# EAGLE schematic FMC_P_CAM (EAGLE 6.5.0)

## Sheet 1 of 4
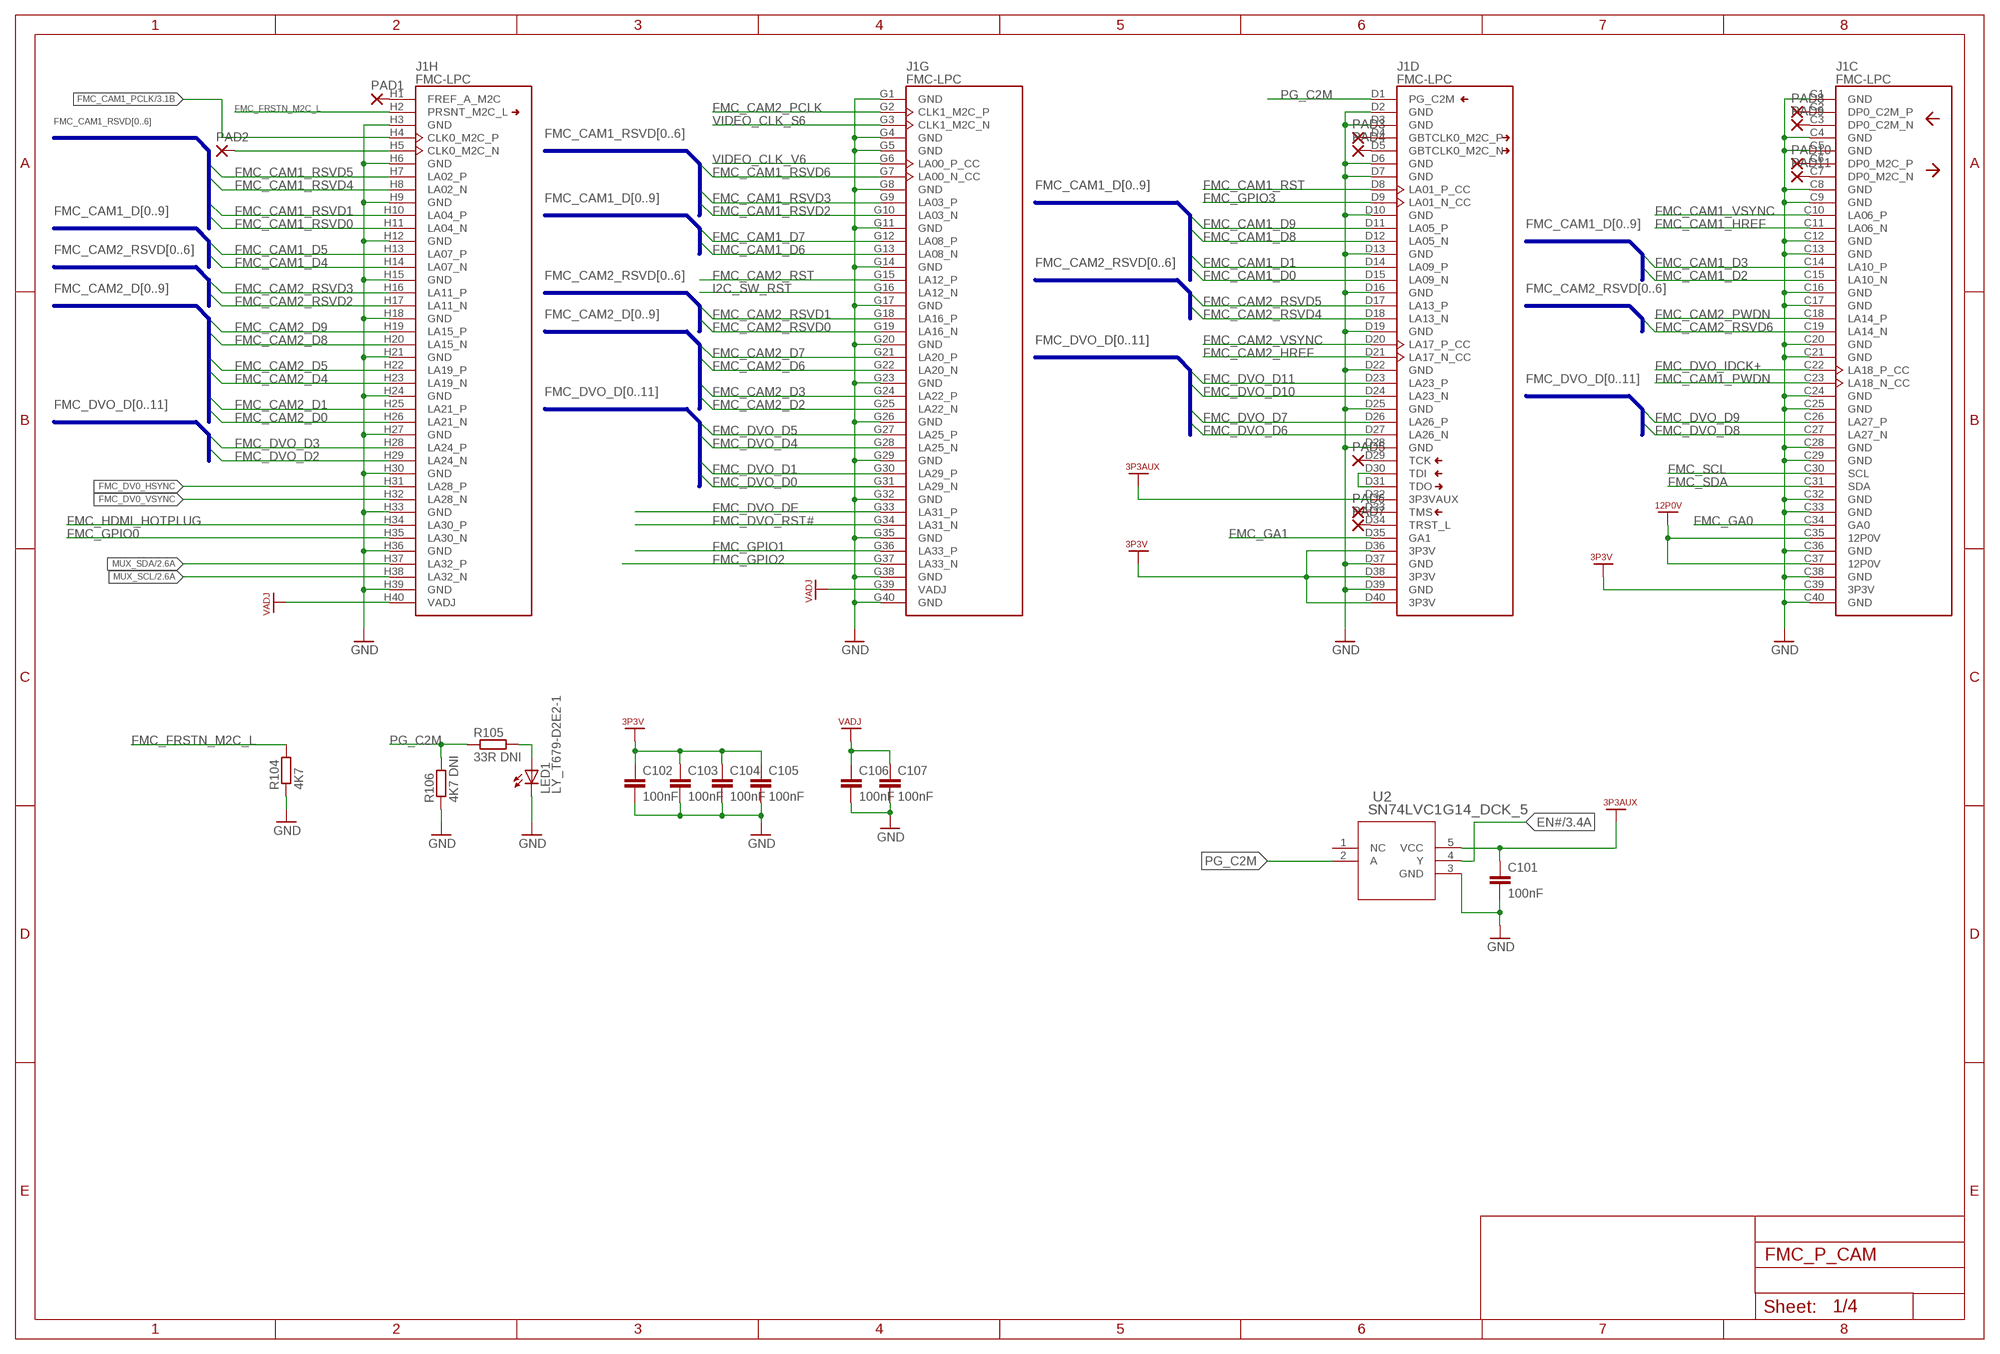
[diagram p0: schematic, sheet 1]

### Parts
C101  100nF  C-EUC0603  [C0603]
C102  100nF  C-EUC0603  [C0603]
C103  100nF  C-EUC0603  [C0603]
C104  100nF  C-EUC0603  [C0603]
C105  100nF  C-EUC0603  [C0603]
C106  100nF  C-EUC0603  [C0603]
C107  100nF  C-EUC0603  [C0603]
J1  FMC-LPC  [FMC-LPC-MALE]
LED1  LY_T679-D2E2-1  [PLCC2]
PAD1  1,6/0,8  [1,6/0,8]
PAD2  1,6/0,8  [1,6/0,8]
PAD3  1,6/0,8  [1,6/0,8]
PAD4  1,6/0,8  [1,6/0,8]
PAD5  1,6/0,8  [1,6/0,8]
PAD6  1,6/0,8  [1,6/0,8]
PAD7  1,6/0,8  [1,6/0,8]
PAD8  1,6/0,8  [1,6/0,8]
PAD9  1,6/0,8  [1,6/0,8]
PAD10  1,6/0,8  [1,6/0,8]
PAD11  1,6/0,8  [1,6/0,8]
R104  4K7  R-EU_R0603  [R0603]
R105  33R DNI  R-EU_R0603  [R0603]
R106  4K7 DNI  R-EU_R0603  [R0603]
U2  SN74LVC1G14_DCK_5  [DCK5]

### Nets
3P3AUX: C101.1 J1.D32(D:3P3VAUX) U2.5(VCC)
3P3V: C102.1 C103.1 C104.1 C105.1 J1.C39(C:3P3V) J1.D36(D:3P3V) J1.D38(D:3P3V) J1.D40(D:3P3V) ; also sheet 2,3
12P0V: J1.C35(C:12P0V) J1.C37(C:12P0V) ; also sheet 4
EN#: U2.4(Y) ; also sheet 3
FMC_CAM1_D0: J1.D15(D:LA09_N) ; also sheet 3
FMC_CAM1_D1: J1.D14(D:LA09_P) ; also sheet 3
FMC_CAM1_D2: J1.C15(C:LA10_N) ; also sheet 3
FMC_CAM1_D3: J1.C14(C:LA10_P) ; also sheet 3
FMC_CAM1_D4: J1.H14(H:LA07_N) ; also sheet 3
FMC_CAM1_D5: J1.H13(H:LA07_P) ; also sheet 3
FMC_CAM1_D6: J1.G13(G:LA08_N) ; also sheet 3
FMC_CAM1_D7: J1.G12(G:LA08_P) ; also sheet 3
FMC_CAM1_D8: J1.D12(D:LA05_N) ; also sheet 3
FMC_CAM1_D9: J1.D11(D:LA05_P) ; also sheet 3
FMC_CAM1_HREF: J1.C11(C:LA06_N) ; also sheet 3
FMC_CAM1_PCLK: J1.H4(H:CLK0_M2C_P) ; also sheet 3
FMC_CAM1_PWDN: J1.C23(C:LA18_N_CC) ; also sheet 3
FMC_CAM1_RST: J1.D8(D:LA01_P_CC) ; also sheet 3
FMC_CAM1_RSVD0: J1.H11(H:LA04_N) ; also sheet 3
FMC_CAM1_RSVD1: J1.H10(H:LA04_P) ; also sheet 3
FMC_CAM1_RSVD2: J1.G10(G:LA03_N) ; also sheet 3
FMC_CAM1_RSVD3: J1.G9(G:LA03_P) ; also sheet 3
FMC_CAM1_RSVD4: J1.H8(H:LA02_N) ; also sheet 3
FMC_CAM1_RSVD5: J1.H7(H:LA02_P) ; also sheet 3
FMC_CAM1_RSVD6: J1.G7(G:LA00_N_CC) ; also sheet 3
FMC_CAM1_VSYNC: J1.C10(C:LA06_P) ; also sheet 3
FMC_CAM2_D0: J1.H26(H:LA21_N) ; also sheet 3
FMC_CAM2_D1: J1.H25(H:LA21_P) ; also sheet 3
FMC_CAM2_D2: J1.G25(G:LA22_N) ; also sheet 3
FMC_CAM2_D3: J1.G24(G:LA22_P) ; also sheet 3
FMC_CAM2_D4: J1.H23(H:LA19_N) ; also sheet 3
FMC_CAM2_D5: J1.H22(H:LA19_P) ; also sheet 3
FMC_CAM2_D6: J1.G22(G:LA20_N) ; also sheet 3
FMC_CAM2_D7: J1.G21(G:LA20_P) ; also sheet 3
FMC_CAM2_D8: J1.H20(H:LA15_N) ; also sheet 3
FMC_CAM2_D9: J1.H19(H:LA15_P) ; also sheet 3
FMC_CAM2_HREF: J1.D21(D:LA17_N_CC) ; also sheet 3
FMC_CAM2_PCLK: J1.G2(G:CLK1_M2C_P) ; also sheet 3
FMC_CAM2_PWDN: J1.C18(C:LA14_P) ; also sheet 3
FMC_CAM2_RST: J1.G15(G:LA12_P) ; also sheet 3
FMC_CAM2_RSVD0: J1.G19(G:LA16_N) ; also sheet 3
FMC_CAM2_RSVD1: J1.G18(G:LA16_P) ; also sheet 3
FMC_CAM2_RSVD2: J1.H17(H:LA11_N) ; also sheet 3
FMC_CAM2_RSVD3: J1.H16(H:LA11_P) ; also sheet 3
FMC_CAM2_RSVD4: J1.D18(D:LA13_N) ; also sheet 3
FMC_CAM2_RSVD5: J1.D17(D:LA13_P) ; also sheet 3
FMC_CAM2_RSVD6: J1.C19(C:LA14_N) ; also sheet 3
FMC_CAM2_VSYNC: J1.D20(D:LA17_P_CC) ; also sheet 3
FMC_DV0_HSYNC: J1.H31(H:LA28_P)
FMC_DV0_VSYNC: J1.H32(H:LA28_N)
FMC_DVO_D0: J1.G31(G:LA29_N)
FMC_DVO_D1: J1.G30(G:LA29_P)
FMC_DVO_D2: J1.H29(H:LA24_N)
FMC_DVO_D3: J1.H28(H:LA24_P)
FMC_DVO_D4: J1.G28(G:LA25_N)
FMC_DVO_D5: J1.G27(G:LA25_P)
FMC_DVO_D6: J1.D27(D:LA26_N)
FMC_DVO_D7: J1.D26(D:LA26_P)
FMC_DVO_D8: J1.C27(C:LA27_N)
FMC_DVO_D9: J1.C26(C:LA27_P)
FMC_DVO_D10: J1.D24(D:LA23_N)
FMC_DVO_D11: J1.D23(D:LA23_P)
FMC_DVO_DE: J1.G33(G:LA31_P)
FMC_DVO_IDCK+: J1.C22(C:LA18_P_CC)
FMC_DVO_RST#: J1.G34(G:LA31_N)
FMC_FRSTN_M2C_L: J1.H2(H:PRSNT_M2C_L) R104.2
FMC_GA0: J1.C34(C:GA0)
FMC_GA1: J1.D35(D:GA1)
FMC_GPIO0: J1.H35(H:LA30_N)
FMC_GPIO1: J1.G36(G:LA33_P)
FMC_GPIO2: J1.G37(G:LA33_N)
FMC_GPIO3: J1.D9(D:LA01_N_CC)
FMC_HDMI_HOTPLUG: J1.H34(H:LA30_P)
FMC_SCL: J1.C30(C:SCL)
FMC_SDA: J1.C31(C:SDA)
GND: C101.2 C102.2 C103.2 C104.2 C105.2 C106.2 C107.2 J1.C1(C:GND) J1.C4(C:GND) J1.C5(C:GND) J1.C8(C:GND) J1.C9(C:GND) J1.C12(C:GND) J1.C13(C:GND) J1.C16(C:GND) J1.C17(C:GND) J1.C20(C:GND) J1.C21(C:GND) J1.C24(C:GND) J1.C25(C:GND) J1.C28(C:GND) J1.C29(C:GND) J1.C32(C:GND) J1.C33(C:GND) J1.C36(C:GND) J1.C38(C:GND) J1.C40(C:GND) J1.D2(D:GND) J1.D3(D:GND) J1.D6(D:GND) J1.D7(D:GND) J1.D10(D:GND) J1.D13(D:GND) J1.D16(D:GND) J1.D19(D:GND) J1.D22(D:GND) J1.D25(D:GND) J1.D28(D:GND) J1.D37(D:GND) J1.D39(D:GND) J1.G1(G:GND) J1.G4(G:GND) J1.G5(G:GND) J1.G8(G:GND) J1.G11(G:GND) J1.G14(G:GND) J1.G17(G:GND) J1.G20(G:GND) J1.G23(G:GND) J1.G26(G:GND) J1.G29(G:GND) J1.G32(G:GND) J1.G35(G:GND) J1.G38(G:GND) J1.G40(G:GND) J1.H3(H:GND) J1.H6(H:GND) J1.H9(H:GND) J1.H12(H:GND) J1.H15(H:GND) J1.H18(H:GND) J1.H21(H:GND) J1.H24(H:GND) J1.H27(H:GND) J1.H30(H:GND) J1.H33(H:GND) J1.H36(H:GND) J1.H39(H:GND) LED1.C R104.1 R106.1 U2.3(GND) ; also sheet 2,3,4
I2C_SW_RST: J1.G16(G:LA12_N) ; also sheet 2
MUX_SCL: J1.H38(H:LA32_N) ; also sheet 2
MUX_SDA: J1.H37(H:LA32_P) ; also sheet 2
N$1: J1.H5(H:CLK0_M2C_N) PAD2.1(P)
N$2: LED1.A R105.2
N$4: J1.D30(D:TDI) J1.D31(D:TDO)
N$22: J1.H1(H:FREF_A_M2C) PAD1.1(P)
N$26: J1.D4(D:GBTCLK0_M2C_P) PAD3.1(P)
N$27: J1.D5(D:GBTCLK0_M2C_N) PAD4.1(P)
N$28: J1.D29(D:TCK) PAD5.1(P)
N$29: J1.D33(D:TMS) PAD6.1(P)
N$30: J1.D34(D:TRST_L) PAD7.1(P)
N$31: J1.C2(C:DP0_C2M_P) PAD8.1(P)
N$32: J1.C3(C:DP0_C2M_N) PAD9.1(P)
N$33: J1.C6(C:DP0_M2C_P) PAD10.1(P)
N$34: J1.C7(C:DP0_M2C_N) PAD11.1(P)
PG_C2M: J1.D1(D:PG_C2M) R105.1 R106.2 U2.2(A)
VADJ: C106.1 C107.1 J1.G39(G:VADJ) J1.H40(H:VADJ) ; also sheet 2,3
VIDEO_CLK_S6: J1.G3(G:CLK1_M2C_N)
VIDEO_CLK_V6: J1.G6(G:LA00_P_CC)
Unconnected: U2.1(NC)

### Buses
FMC_CAM1_RSVD[0..6]
FMC_CAM1_D[0..9]
FMC_CAM2_RSVD[0..6]
FMC_CAM2_D[0..9]
FMC_DVO_D[0..11]

## Sheet 2 of 4
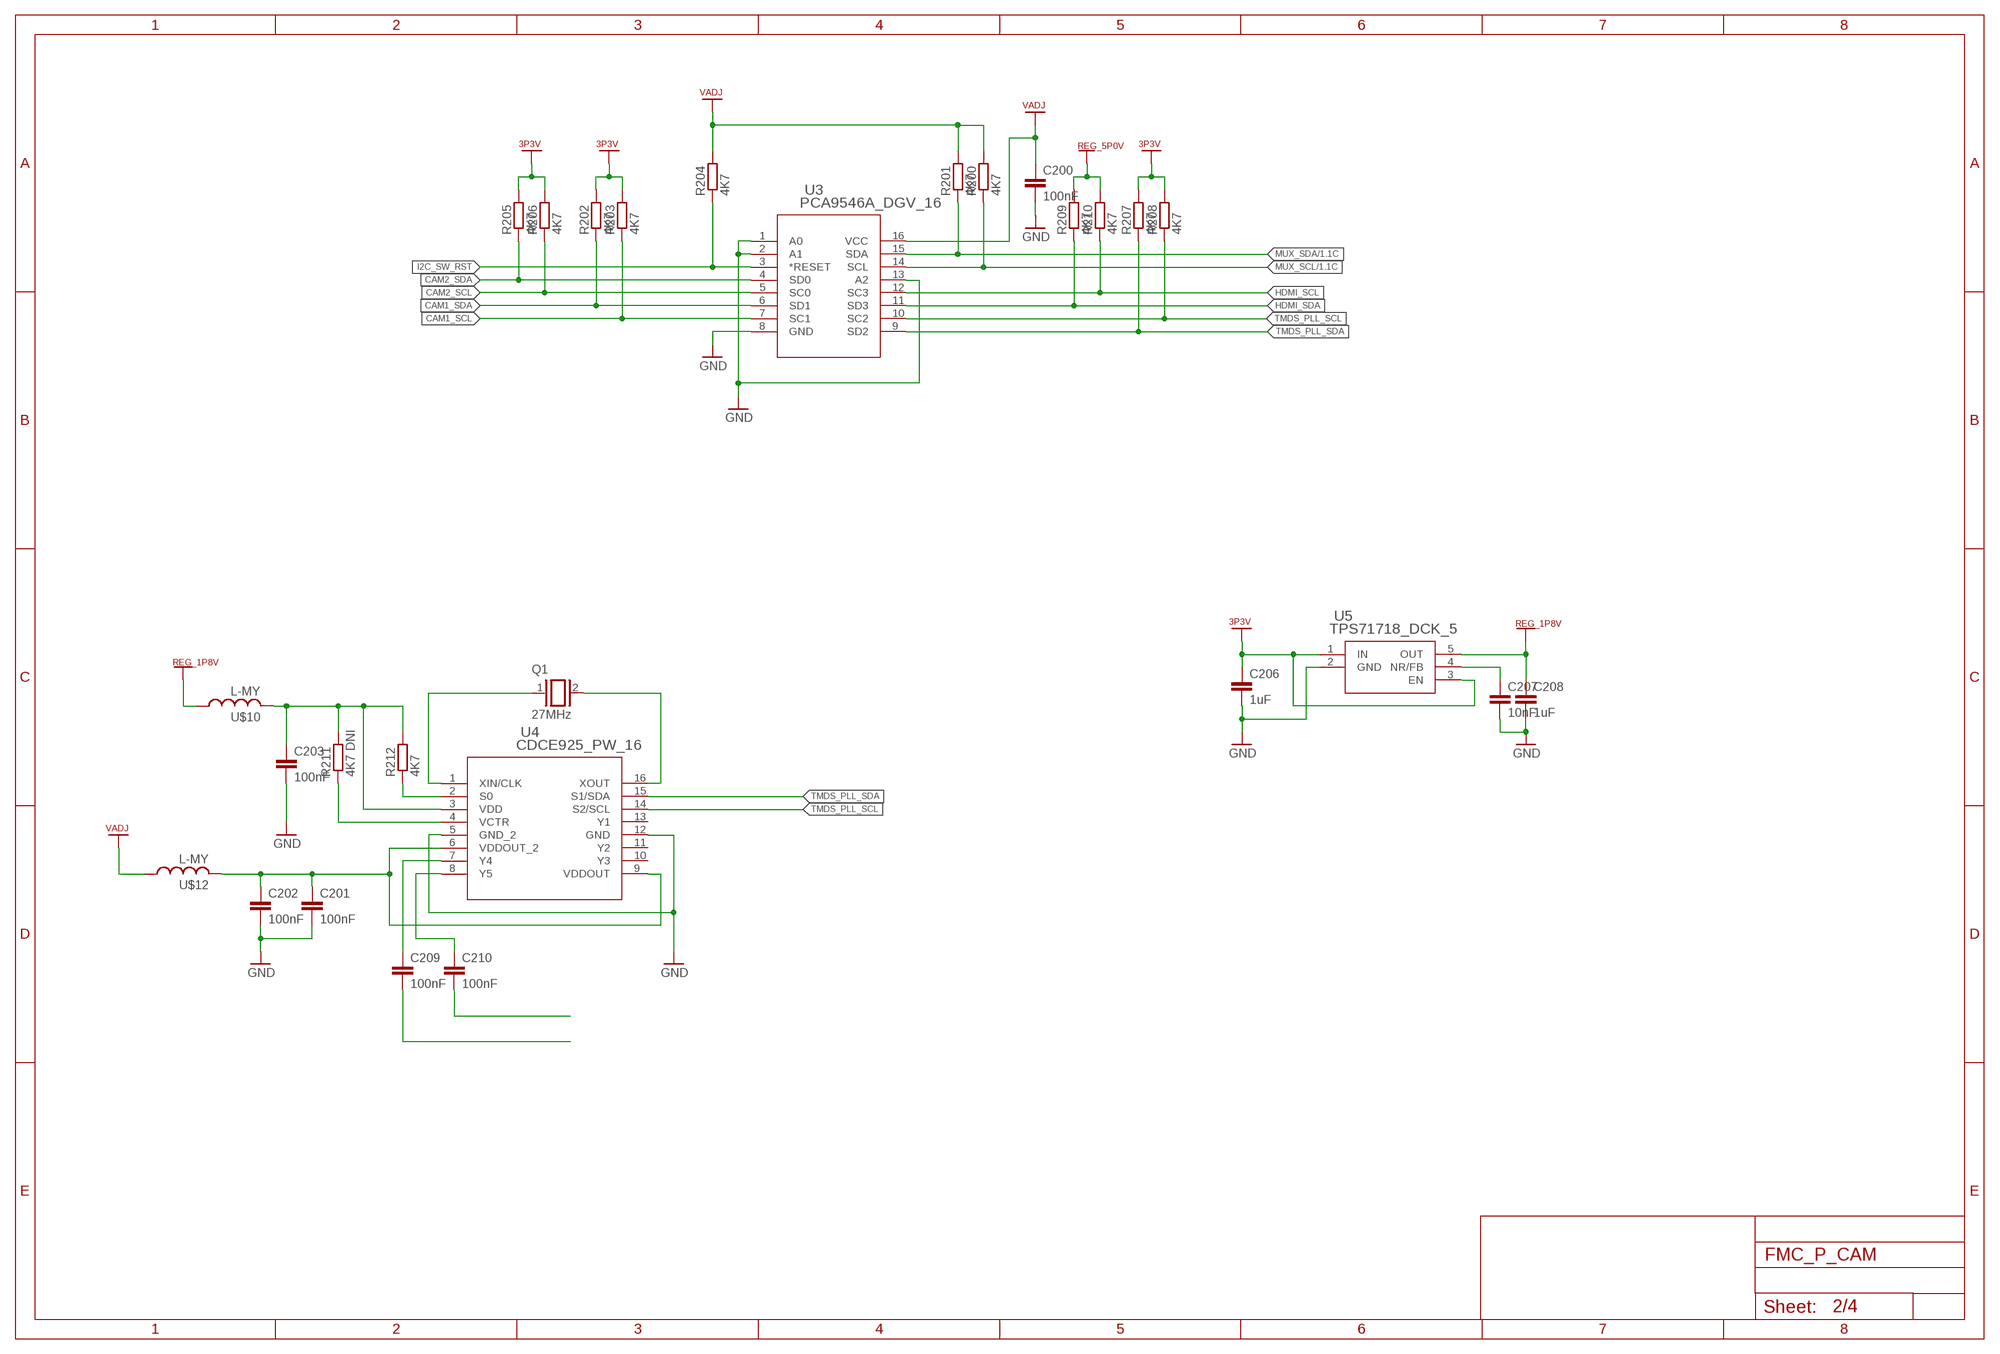
[diagram p1: schematic, sheet 2]

### Parts
C200  100nF  C-EUC0603  [C0603]
C201  100nF  C-EUC0603  [C0603]
C202  100nF  C-EUC0603  [C0603]
C203  100nF  C-EUC0603  [C0603]
C206  1uF  C-EUC0603  [C0603]
C207  10nF  C-EUC0603  [C0603]
C208  1uF  C-EUC0603  [C0603]
C209  100nF  C-EUC0603  [C0603]
C210  100nF  C-EUC0603  [C0603]
Q1  27MHz  XTAL  [Q]
R200  4K7  R-EU_R0603  [R0603]
R201  4K7  R-EU_R0603  [R0603]
R202  4K7  R-EU_R0603  [R0603]
R203  4K7  R-EU_R0603  [R0603]
R204  4K7  R-EU_R0603  [R0603]
R205  4K7  R-EU_R0603  [R0603]
R206  4K7  R-EU_R0603  [R0603]
R207  4K7  R-EU_R0603  [R0603]
R208  4K7  R-EU_R0603  [R0603]
R209  4K7  R-EU_R0603  [R0603]
R210  4K7  R-EU_R0603  [R0603]
R211  4K7 DNI  R-EU_R0603  [R0603]
R212  4K7  R-EU_R0603  [R0603]
U3  PCA9546A_DGV_16  [DGV16]
U4  CDCE925_PW_16  [PW16]
U5  TPS71718_DCK_5  [DCK5]
U$10  L-MY  [R0603]
U$12  L-MY  [R0603]

### Nets
3P3V: C206.1 R202.2 R203.2 R205.2 R206.2 R207.2 R208.2 U5.1(IN) U5.3(EN) ; also sheet 1,3
CAM1_SCL: R203.1 U3.7(SC1)
CAM1_SDA: R202.1 U3.6(SD1)
CAM1_XCLK: C210.2
CAM2_SCL: R206.1 U3.5(SC0)
CAM2_SDA: R205.1 U3.4(SD0)
CAM2_XCLK: C209.2
GND: C200.2 C201.2 C202.2 C203.2 C206.2 C207.2 C208.2 U3.1(A0) U3.2(A1) U3.8(GND) U3.13(A2) U4.5(GND_2) U4.12(GND) U5.2(GND) ; also sheet 1,3,4
HDMI_SCL: R210.1 U3.12(SC3)
HDMI_SDA: R209.1 U3.11(SD3)
I2C_SW_RST: R204.1 U3.3(*RESET) ; also sheet 1
MUX_SCL: R200.1 U3.14(SCL) ; also sheet 1
MUX_SDA: R201.1 U3.15(SDA) ; also sheet 1
N$3: Q1.1 U4.1(XIN/CLK)
N$5: Q1.2 U4.16(XOUT)
N$6: C203.1 R211.2 R212.2 U4.3(VDD) U$10.2
N$7: R212.1 U4.2(S0)
N$8: R211.1 U4.4(VCTR)
N$9: C201.1 C202.1 U4.6(VDDOUT_2) U4.9(VDDOUT) U$12.2
N$10: C209.1 U4.7(Y4)
N$11: C210.1 U4.8(Y5)
N$13: C207.1 U5.4(NR/FB)
REG_1P8V: C208.1 U5.5(OUT) U$10.1
REG_5P0V: R209.2 R210.2 ; also sheet 4
TMDS_PLL_SCL: R208.1 U3.10(SC2) U4.14(S2/SCL)
TMDS_PLL_SDA: R207.1 U3.9(SD2) U4.15(S1/SDA)
VADJ: C200.1 R200.2 R201.2 R204.2 U3.16(VCC) U$12.1 ; also sheet 1,3
Unconnected: U4.10(Y3) U4.11(Y2) U4.13(Y1)

## Sheet 3 of 4
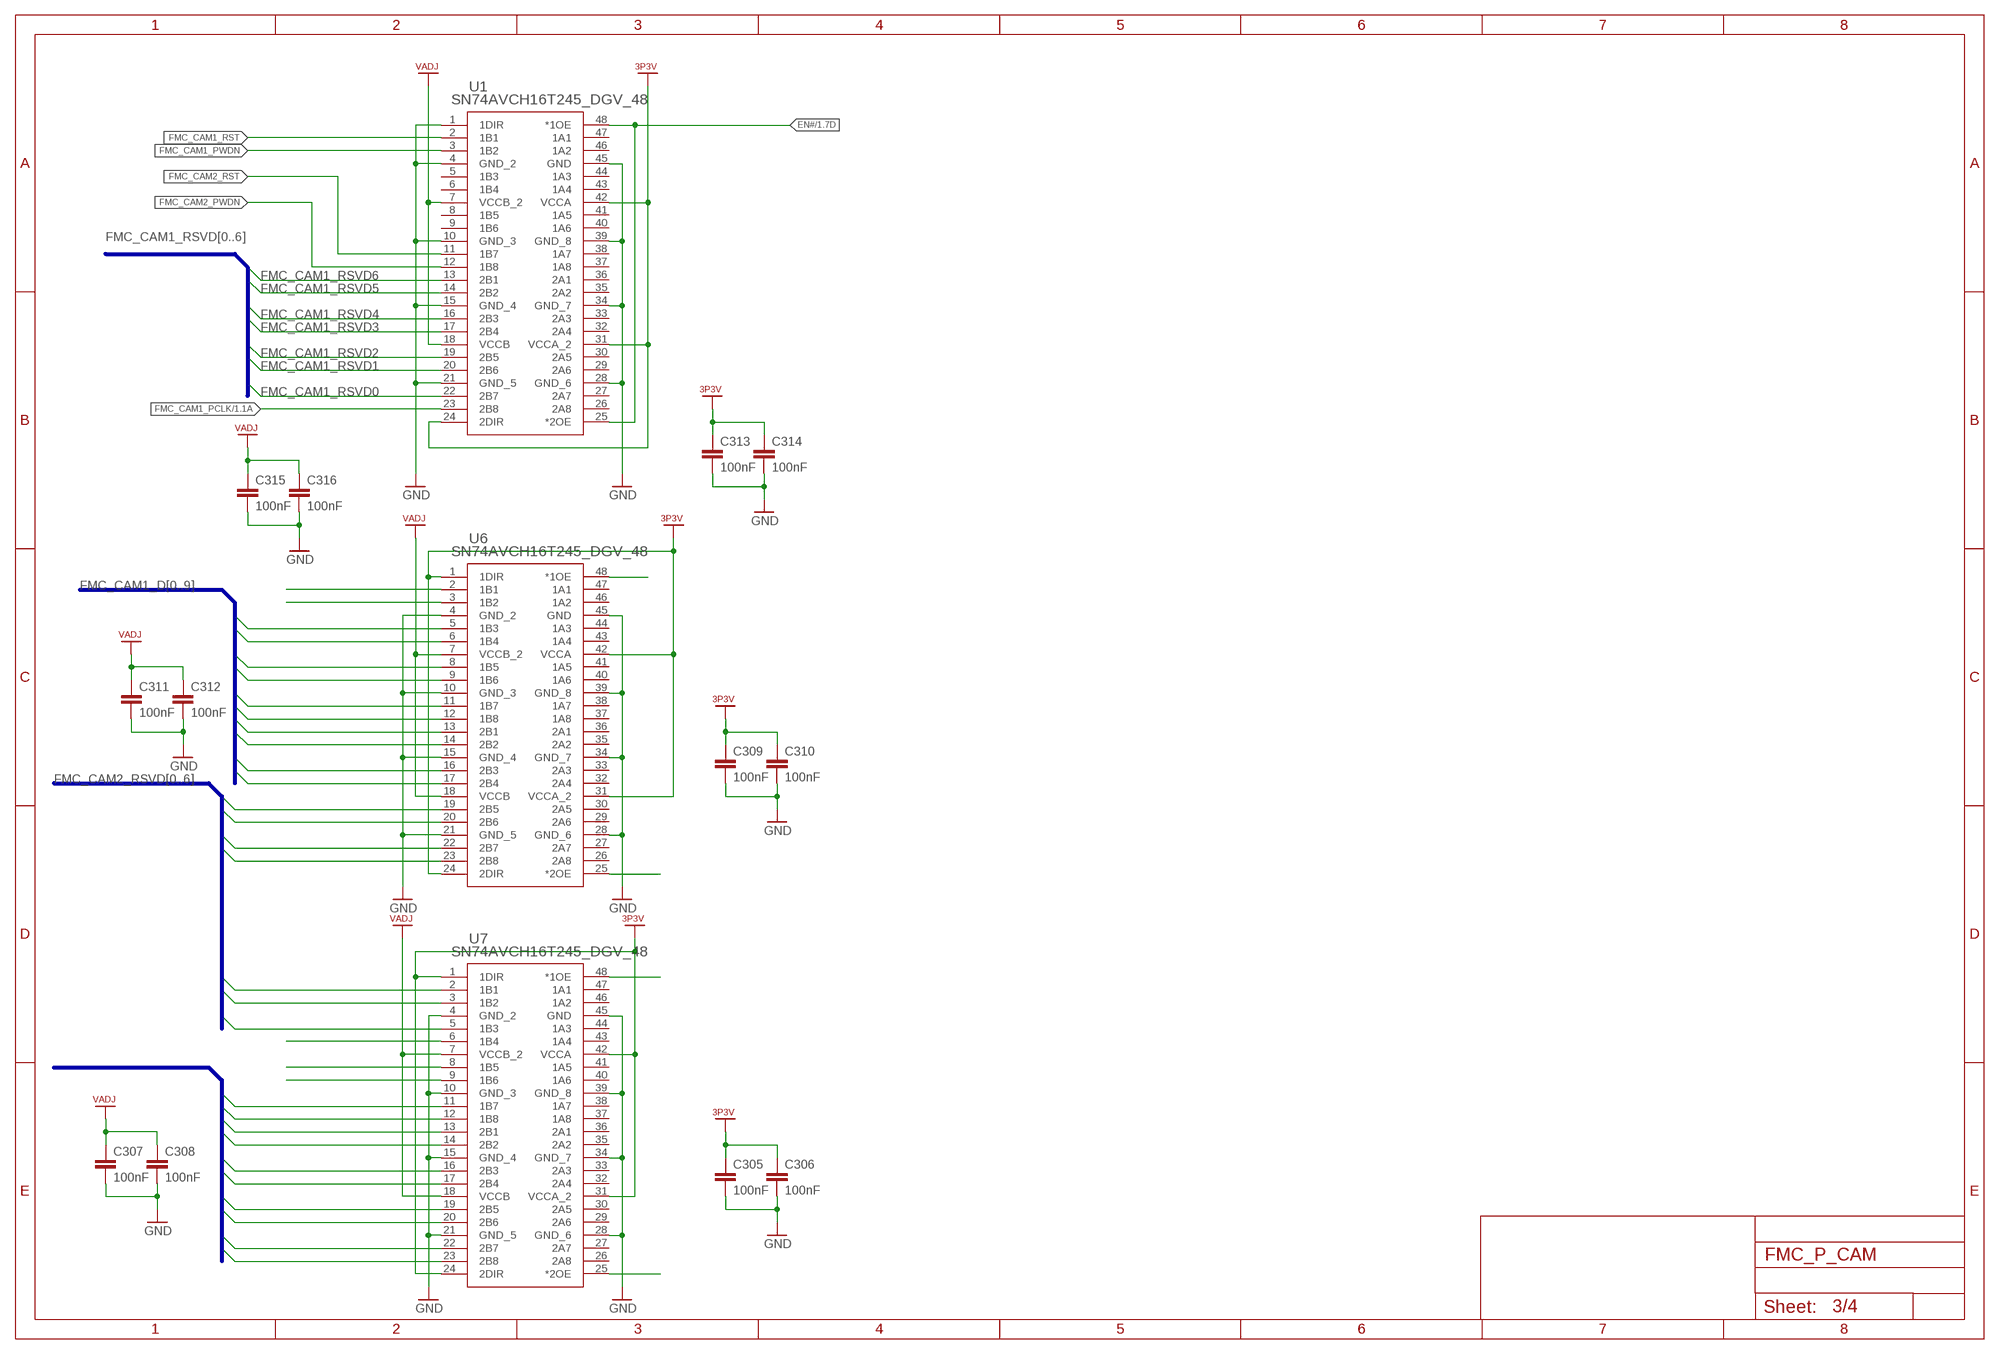
[diagram p2: schematic, sheet 3]

### Parts
C305  100nF  C-EUC0603  [C0603]
C306  100nF  C-EUC0603  [C0603]
C307  100nF  C-EUC0603  [C0603]
C308  100nF  C-EUC0603  [C0603]
C309  100nF  C-EUC0603  [C0603]
C310  100nF  C-EUC0603  [C0603]
C311  100nF  C-EUC0603  [C0603]
C312  100nF  C-EUC0603  [C0603]
C313  100nF  C-EUC0603  [C0603]
C314  100nF  C-EUC0603  [C0603]
C315  100nF  C-EUC0603  [C0603]
C316  100nF  C-EUC0603  [C0603]
U1  SN74AVCH16T245_DGV_48  [DGV48]
U6  SN74AVCH16T245_DGV_48  [DGV48]
U7  SN74AVCH16T245_DGV_48  [DGV48]

### Nets
3P3V: C305.1 C306.1 C309.1 C310.1 C313.1 C314.1 U1.24(2DIR) U1.31(VCCA_2) U1.42(VCCA) U6.1(1DIR) U6.24(2DIR) U6.31(VCCA_2) U6.42(VCCA) U7.1(1DIR) U7.24(2DIR) U7.31(VCCA_2) U7.42(VCCA) ; also sheet 1,2
EN#: U1.25(*2OE) U1.48(*1OE) U6.25(*2OE) U6.48(*1OE) U7.25(*2OE) U7.48(*1OE) ; also sheet 1
FMC_CAM1_D0: U6.17(2B4) ; also sheet 1
FMC_CAM1_D1: U6.16(2B3) ; also sheet 1
FMC_CAM1_D2: U6.14(2B2) ; also sheet 1
FMC_CAM1_D3: U6.13(2B1) ; also sheet 1
FMC_CAM1_D4: U6.12(1B8) ; also sheet 1
FMC_CAM1_D5: U6.11(1B7) ; also sheet 1
FMC_CAM1_D6: U6.9(1B6) ; also sheet 1
FMC_CAM1_D7: U6.8(1B5) ; also sheet 1
FMC_CAM1_D8: U6.6(1B4) ; also sheet 1
FMC_CAM1_D9: U6.5(1B3) ; also sheet 1
FMC_CAM1_HREF: U6.3(1B2) ; also sheet 1
FMC_CAM1_PCLK: U1.23(2B8) ; also sheet 1
FMC_CAM1_PWDN: U1.3(1B2) ; also sheet 1
FMC_CAM1_RST: U1.2(1B1) ; also sheet 1
FMC_CAM1_RSVD0: U1.22(2B7) ; also sheet 1
FMC_CAM1_RSVD1: U1.20(2B6) ; also sheet 1
FMC_CAM1_RSVD2: U1.19(2B5) ; also sheet 1
FMC_CAM1_RSVD3: U1.17(2B4) ; also sheet 1
FMC_CAM1_RSVD4: U1.16(2B3) ; also sheet 1
FMC_CAM1_RSVD5: U1.14(2B2) ; also sheet 1
FMC_CAM1_RSVD6: U1.13(2B1) ; also sheet 1
FMC_CAM1_VSYNC: U6.2(1B1) ; also sheet 1
FMC_CAM2_D0: U7.23(2B8) ; also sheet 1
FMC_CAM2_D1: U7.22(2B7) ; also sheet 1
FMC_CAM2_D2: U7.20(2B6) ; also sheet 1
FMC_CAM2_D3: U7.19(2B5) ; also sheet 1
FMC_CAM2_D4: U7.17(2B4) ; also sheet 1
FMC_CAM2_D5: U7.16(2B3) ; also sheet 1
FMC_CAM2_D6: U7.14(2B2) ; also sheet 1
FMC_CAM2_D7: U7.13(2B1) ; also sheet 1
FMC_CAM2_D8: U7.12(1B8) ; also sheet 1
FMC_CAM2_D9: U7.11(1B7) ; also sheet 1
FMC_CAM2_HREF: U7.9(1B6) ; also sheet 1
FMC_CAM2_PCLK: U7.6(1B4) ; also sheet 1
FMC_CAM2_PWDN: U1.12(1B8) ; also sheet 1
FMC_CAM2_RST: U1.11(1B7) ; also sheet 1
FMC_CAM2_RSVD0: U7.5(1B3) ; also sheet 1
FMC_CAM2_RSVD1: U7.3(1B2) ; also sheet 1
FMC_CAM2_RSVD2: U7.2(1B1) ; also sheet 1
FMC_CAM2_RSVD3: U6.23(2B8) ; also sheet 1
FMC_CAM2_RSVD4: U6.22(2B7) ; also sheet 1
FMC_CAM2_RSVD5: U6.20(2B6) ; also sheet 1
FMC_CAM2_RSVD6: U6.19(2B5) ; also sheet 1
FMC_CAM2_VSYNC: U7.8(1B5) ; also sheet 1
GND: C305.2 C306.2 C307.2 C308.2 C309.2 C310.2 C311.2 C312.2 C313.2 C314.2 C315.2 C316.2 U1.1(1DIR) U1.4(GND_2) U1.10(GND_3) U1.15(GND_4) U1.21(GND_5) U1.28(GND_6) U1.34(GND_7) U1.39(GND_8) U1.45(GND) U6.4(GND_2) U6.10(GND_3) U6.15(GND_4) U6.21(GND_5) U6.28(GND_6) U6.34(GND_7) U6.39(GND_8) U6.45(GND) U7.4(GND_2) U7.10(GND_3) U7.15(GND_4) U7.21(GND_5) U7.28(GND_6) U7.34(GND_7) U7.39(GND_8) U7.45(GND) ; also sheet 1,2,4
VADJ: C307.1 C308.1 C311.1 C312.1 C315.1 C316.1 U1.7(VCCB_2) U1.18(VCCB) U6.7(VCCB_2) U6.18(VCCB) U7.7(VCCB_2) U7.18(VCCB) ; also sheet 1,2
Unconnected: U1.5(1B3) U1.6(1B4) U1.8(1B5) U1.9(1B6) U1.26(2A8) U1.27(2A7) U1.29(2A6) U1.30(2A5) U1.32(2A4) U1.33(2A3) U1.35(2A2) U1.36(2A1) U1.37(1A8) U1.38(1A7) U1.40(1A6) U1.41(1A5) U1.43(1A4) U1.44(1A3) U1.46(1A2) U1.47(1A1) U6.26(2A8) U6.27(2A7) U6.29(2A6) U6.30(2A5) U6.32(2A4) U6.33(2A3) U6.35(2A2) U6.36(2A1) U6.37(1A8) U6.38(1A7) U6.40(1A6) U6.41(1A5) U6.43(1A4) U6.44(1A3) U6.46(1A2) U6.47(1A1) U7.26(2A8) U7.27(2A7) U7.29(2A6) U7.30(2A5) U7.32(2A4) U7.33(2A3) U7.35(2A2) U7.36(2A1) U7.37(1A8) U7.38(1A7) U7.40(1A6) U7.41(1A5) U7.43(1A4) U7.44(1A3) U7.46(1A2) U7.47(1A1)

### Buses
FMC_CAM1_RSVD[0..6]
FMC_CAM1_D[0..9]
FMC_CAM2_RSVD[0..6]
FMC_CAM2_D[0..9]

## Sheet 4 of 4
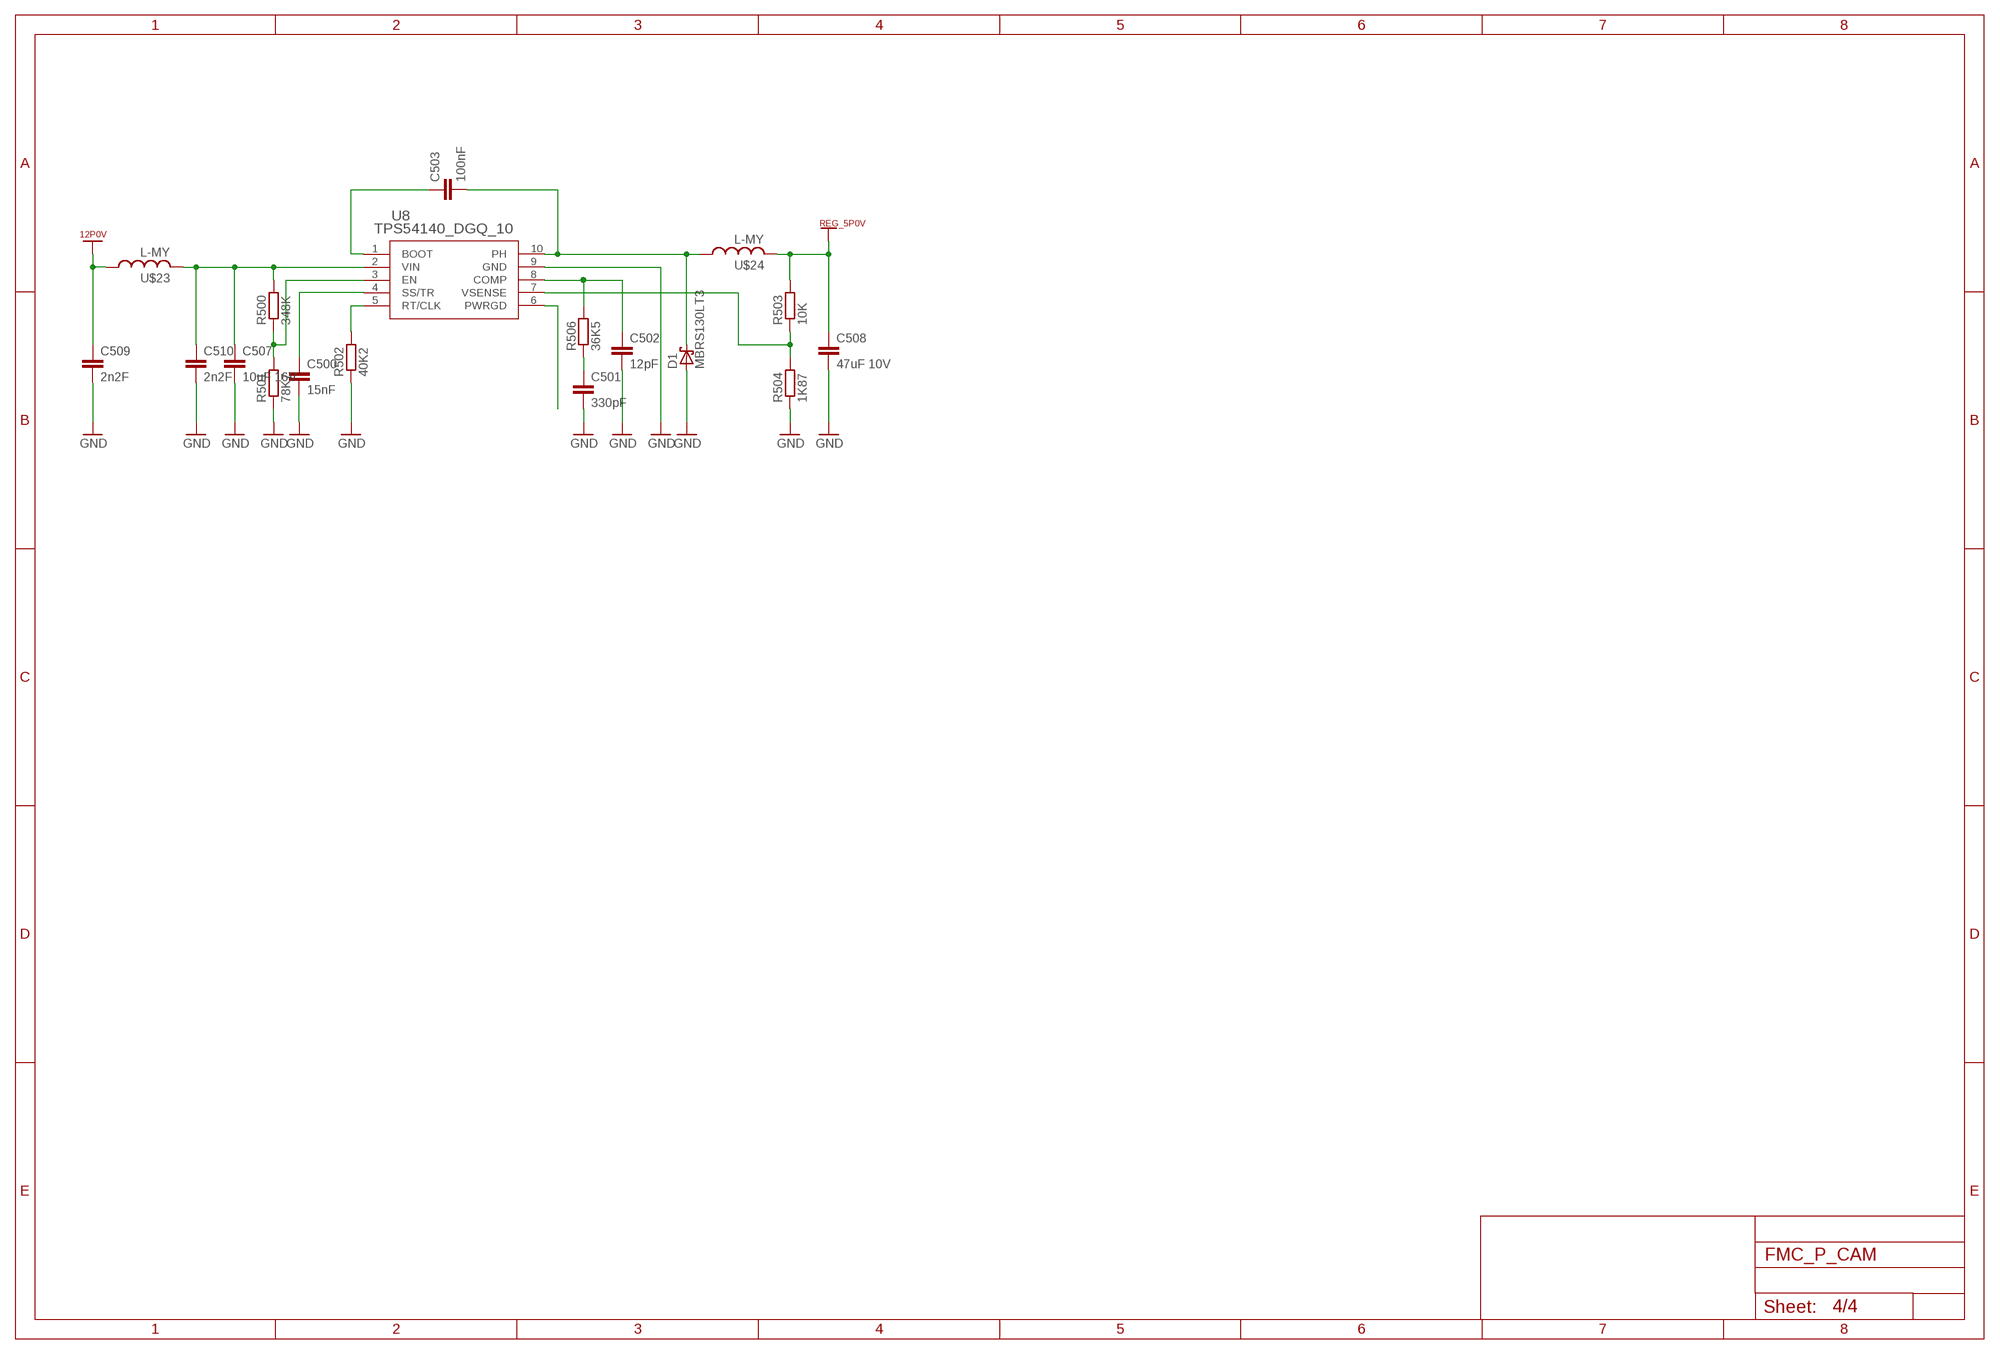
[diagram p3: schematic, sheet 4]

### Parts
C500  15nF  C-EUC0603  [C0603]
C501  330pF  C-EUC0603  [C0603]
C502  12pF  C-EUC0603  [C0603]
C503  100nF  C-EUC0603  [C0603]
C507  10uF 16V  C-EUC0603  [C0603]
C508  47uF 10V  C-EUC0603  [C0603]
C509  2n2F  C-EUC0603  [C0603]
C510  2n2F  C-EUC0603  [C0603]
D1  MBRS130LT3  [SMB]
R500  348K  R-EU_R0603  [R0603]
R501  78K7  R-EU_R0603  [R0603]
R502  40K2  R-EU_R0603  [R0603]
R503  10K  R-EU_R0603  [R0603]
R504  1K87  R-EU_R0603  [R0603]
R506  36K5  R-EU_R0603  [R0603]
U8  TPS54140_DGQ_10  [DGQ10_1P88X1P57]
U$23  L-MY  [R0603]
U$24  L-MY  [R0603]

### Nets
12P0V: C509.1 U$23.1 ; also sheet 1
GND: C500.2 C501.2 C502.2 C507.2 C508.2 C509.2 C510.2 D1.A R501.1 R502.1 R504.1 U8.9(GND) ; also sheet 1,2,3
N$15: C507.1 C510.1 R500.2 U8.2(VIN) U$23.2
N$16: C503.1 U8.1(BOOT)
N$17: C503.2 D1.C U8.10(PH) U$24.1
N$19: R500.1 R501.2 U8.3(EN)
N$20: C500.1 U8.4(SS/TR)
N$21: R502.2 U8.5(RT/CLK)
N$23: C502.1 R506.2 U8.8(COMP)
N$24: C501.1 R506.1
N$25: R503.1 R504.2 U8.7(VSENSE)
PGOOD: U8.6(PWRGD)
REG_5P0V: C508.1 R503.2 U$24.2 ; also sheet 2

## Library data of the parts
C101-C107 = resistor:C-EU: CAPACITOR, European symbol
C200-C203 C206-C210 = my-rcl:C-EU: CAPACITOR, European symbol
C305-C316 C500-C503 C507-C510 = rcl:C-EU: CAPACITOR, European symbol
D1 = diode:MBRS130LT3: Schottky Power Rectifier Source: http://www.onsemi.com/pub/Collateral/MBRS130LT3-D.PDF
J1 = fmc_zed:FMC-LPC: FMC-LPC Bottom side connector for interfacing with Xilinx FPGA development boards (e.g. SP605); OC_NEWARK: unknown
LED1 = led:*_T679-?-1: LC TOPLED® Low Current LED Source: http://catalog.osram-os.com .. LG_LS_LY_T679_OBS.pdf; COLOR: yellow
PAD1-PAD11 = wirepad:1,6/0,8: THROUGH-HOLE PAD
Q1 = special:XTAL: CRYSTAL
R104-R106 R200-R212 = resistor:R-EU_: RESISTOR, European symbol
R500-R504 R506 = rcl:R-EU_: RESISTOR, European symbol
U1 U6 U7 = SN74AVCH16T245_DGV_48:SN74AVCH16T245_DGV_48; DATASHEETURL: http://www.ti.com/lit/gpn/SN74AVCH16T245; DESCRIPTION: 16-Bit Dual Supply Bus Transceiver with Configurable Voltage Translation and 3-State Outputs; FAMILY_NAME: DIRECTION CONTROL DUAL SUPPLY TRANSLATOR; GENERIC_PART_NUMBER: SN74AVCH16T245; INDUSTRY_STD_PKG_TYPE: TVSOP; MANUFACTURER: Texas Instruments; MANUFACTURER_PART_NUMBER: sn74avch16t245_dgv_48; OC_NEWARK: unknown; PACKAGE_DESIGNATOR: DGV; PIN_COUNT: 48; VENDOR: Texas Instruments
U2 = SN74LVC1G14_DCK_5:SN74LVC1G14_DCK_5; DATASHEETURL: http://www.ti.com/lit/gpn/SN74LVC1G14; DESCRIPTION: Single Schmitt-Trigger Inverter; FAMILY_NAME: LL INVERTER; GENERIC_PART_NUMBER: SN74LVC1G14; INDUSTRY_STD_PKG_TYPE: SC70; MANUFACTURER: Texas Instruments; MANUFACTURER_PART_NUMBER: sn74lvc1g14_dck_5; PACKAGE_DESIGNATOR: DCK; PIN_COUNT: 5; VENDOR: Texas Instruments
U3 = PCA9546A_DGV_16:PCA9546A_DGV_16; DATASHEETURL: http://www.ti.com/lit/gpn/PCA9546A; DESCRIPTION: 4-Channel I2C And SMBus Multiplexer With Reset Functions; FAMILY_NAME: I2C MULTIPLEXER, SWITCH; GENERIC_PART_NUMBER: PCA9546A; INDUSTRY_STD_PKG_TYPE: TVSOP; MANUFACTURER: Texas Instruments; MANUFACTURER_PART_NUMBER: pca9546a_dgv_16; PACKAGE_DESIGNATOR: DGV; PIN_COUNT: 16; VENDOR: Texas Instruments
U4 = CDCE925_PW_16:CDCE925_PW_16; DATASHEETURL: http://www.ti.com/lit/gpn/CDCE925; DESCRIPTION: Programmable 2-PLL VCXO Clock Synthesizer with 2.5-V or 3.3-V LVCMOS Outputs; FAMILY_NAME: VCXO INPUT; GENERIC_PART_NUMBER: CDCE925; INDUSTRY_STD_PKG_TYPE: TSSOP; MANUFACTURER: Texas Instruments; PACKAGE_DESIGNATOR: PW; PIN_COUNT: 16
U5 = TPS71718_DCK_5:TPS71718_DCK_5; DATASHEETURL: http://www.ti.com/lit/gpn/TPS71718; DESCRIPTION: Single Output LDO, 150mA, Fixed(1.8V), High PSRR, Low Quiescent Current, Low Noise; FAMILY_NAME: SINGLE CHANNEL LDO; GENERIC_PART_NUMBER: TPS71718; INDUSTRY_STD_PKG_TYPE: SC70; MANUFACTURER: Texas Instruments; MANUFACTURER_PART_NUMBER: tps71718_dck_5; PACKAGE_DESIGNATOR: DCK; PIN_COUNT: 5; VENDOR: Texas Instruments
U8 = TPS54140_DGQ_10:TPS54140_DGQ_10; DATASHEETURL: http://www.ti.com/lit/gpn/TPS54140; DESCRIPTION: 3.5V to 42V Input, 1.5A Step-Down Converter with Eco-Mode; FAMILY_NAME: STEP-DOWN REGULATOR; GENERIC_PART_NUMBER: TPS54140; INDUSTRY_STD_PKG_TYPE: MSOP-PowerPAD; MANUFACTURER: Texas Instruments; MANUFACTURER_PART_NUMBER: tps54140_dgq_10; PACKAGE_DESIGNATOR: DGQ; PIN_COUNT: 10; VENDOR: Texas Instruments
U$10 U$12 U$23 U$24 = my-rcl:L-MY